# Altium schematic sheet TEENSY 1.SchDoc
size A4; SheetNumber: 1; SheetTotal: 1
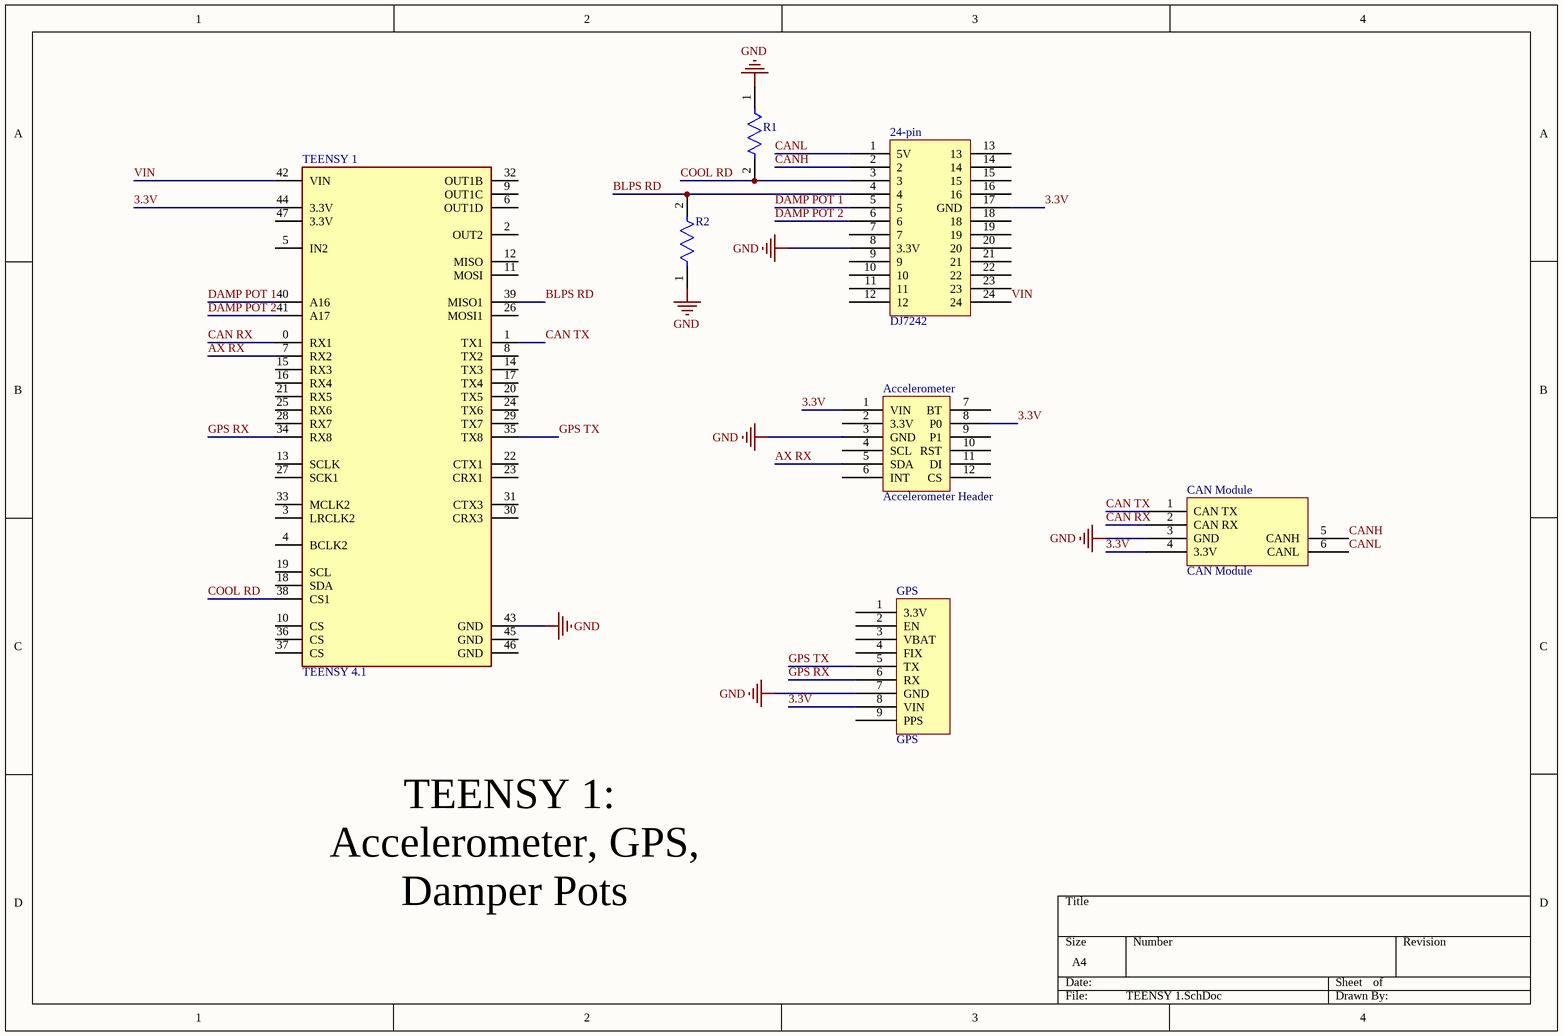
[diagram p0: TEENSY 1.SchDoc]

## Parts
24-pin  DJ7242  [DJ7242-Footprint-1]
Accelerometer  Accelerometer Header  [Accelerometer Header-Footprint-1]
CAN_Module  CAN Module  [CAN Module-Footprint-1]
GPS  GPS  [GPS-Footprint-1]
R1  CMF5073K200FHEB  [FP-CMF50-0]  (value not drawn)
R2  CMF5073K200FHEB  [FP-CMF50-0]  (value not drawn)
TEENSY_1  TEENSY 4.1  [FP-DEV-16996-MFG]

## Nets
GND: 24-pin.8(3.3V) Accelerometer.3(GND) CAN_Module.3(GND) GPS.7(GND) R1.1 R2.1 TEENSY_1.43(GND)
3.3V: 24-pin.17(GND) Accelerometer.1(VIN) Accelerometer.8(P0) CAN_Module.4(3.3V) GPS.8(VIN) TEENSY_1.44(3.3V)
AX RX: Accelerometer.5(SDA) TEENSY_1.7(RX2)
BLPS RD: 24-pin.4 R2.2 TEENSY_1.39(MISO1)
CAN RX: CAN_Module.2(CAN_RX) TEENSY_1.0(RX1)
CAN TX: CAN_Module.1(CAN_TX) TEENSY_1.1(TX1)
CANH: 24-pin.2 CAN_Module.5(CANH)
CANL: 24-pin.1(5V) CAN_Module.6(CANL)
COOL RD: 24-pin.3 R1.2 TEENSY_1.38(CS1)
DAMP POT 1: 24-pin.5 TEENSY_1.40(A16)
DAMP POT 2: 24-pin.6 TEENSY_1.41(A17)
GPS RX: GPS.6(RX) TEENSY_1.34(RX8)
GPS TX: GPS.5(TX) TEENSY_1.35(TX8)
VIN: 24-pin.24 TEENSY_1.42(VIN)

Not connected (* = marked no-connect by the designer): 24-pin 7 9 10 11 12 13 14 15 16 18 19 20 21 22 23; Accelerometer 2(3.3V) 4(SCL) 6(INT) 7(BT) 9(P1) 10(RST) 11(DI) 12(CS); GPS 1(3.3V) 2(EN) 3(VBAT) 4(FIX) 9(PPS); TEENSY_1 2(OUT2) 3(LRCLK2) 4(BCLK2) 5(IN2) 6(OUT1D) 8(TX2) 9(OUT1C) 10(CS) 11(MOSI) 12(MISO) 13(SCLK) 14(TX3) 15(RX3) 16(RX4) 17(TX4) 18(SDA) 19(SCL) 20(TX5) 21(RX5) 22(CTX1) 23(CRX1) 24(TX6) 25(RX6) 26(MOSI1) 27(SCK1) 28(RX7) 29(TX7) 30(CRX3) 31(CTX3) 32(OUT1B) 33(MCLK2) 36(CS) 37(CS) 45(GND) 46(GND) 47(3.3V)

## Notes on the sheet
- TEENSY 1:
  Accelerometer, GPS, Damper Pots

## Library data of the parts
24-pin = CMP-00030-00002-5: 24-pin connector
Accelerometer = CMP-002-00071-3: Header for Adafruit Accelerometer
CAN_Module = CMP-00030-00003-1: CAN waveshare
GPS = CMP-002-00072-2: Adafruit GPS chip
R1 R2 = CMP-00030-44386654-1: CMF5073K200FHEB Res Metal Film 73.2K Ohm 1% 0.125W(1/8W) ±50ppm/°C Epoxy AXL T/R; Max Power Dissipation: 250mW; Voltage Rating: 200V; Power Rating: 125mW; Resistance: 73.2kΩ; Tolerance: 1%; Width: 1.65mm; Length: 3.81mm; Schedule B: 8533210090, 8533210090; Termination: Axial; Lead Free: Lead Free; Diameter: 1.65mm; Voltage Rating (DC): 200V; NexarPartId: 44386654; Packaging: Cut Tape; Max Operating Temperature: 175°C; Composition: Metal Film; RoHS: Compliant; Mount: Through Hole; Features: Flame Retardant Coating, Moisture Resistant; Number of Terminations: 2; Temperature Coefficient: 50ppm/°C; Min Operating Temperature: -55°C; Case/Package: Axial
TEENSY_1 = CMP-157412-000001-1: TEENSY 4.1 (HEADERS)